# EAGLE design Antenna Board v4.2 (EAGLE 9.6.2)
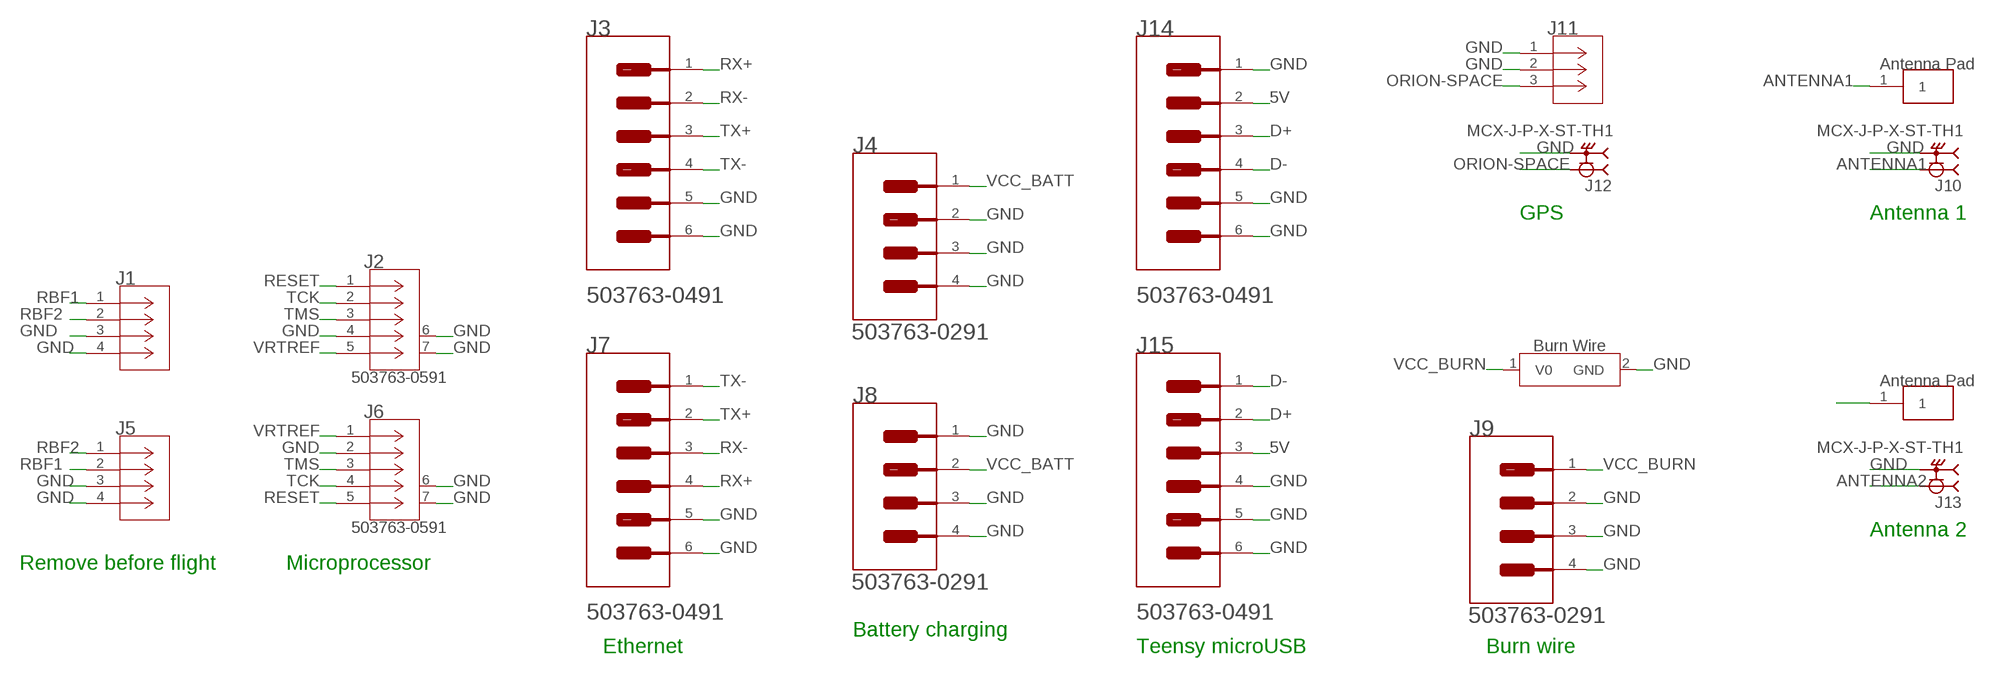
[diagram p0: schematic, sheet 1]

## Parts
J1  5037630291  [CON_5037630291]
J2  503763-0591  [CONN_5037630591_MOL]
J3  MOLEX_503763-0491MOLEX_503763-0491_0_0  [MOLEX_503763-0491_0]
J4  MOLEX_503763-0291MOLEX_503763-0291_0_0  [MOLEX_503763-0291_0]
J5  5037630291  [CON_5037630291]
J6  503763-0591  [CONN_5037630591_MOL]
J7  MOLEX_503763-0491MOLEX_503763-0491_0_0  [MOLEX_503763-0491_0]
J8  MOLEX_503763-0291MOLEX_503763-0291_0_0  [MOLEX_503763-0291_0]
J9  MOLEX_503763-0291MOLEX_503763-0291_0_0  [MOLEX_503763-0291_0]
J10  MCX-J-P-X-ST-TH1  [SAMTEC_MCX-J-P-X-ST-TH1]
J11  U.FL-R-SMT-1(01)  [CONN_-SMT-1(01)]
J12  MCX-J-P-X-ST-TH1  [SAMTEC_MCX-J-P-X-ST-TH1]
J13  MCX-J-P-X-ST-TH1  [SAMTEC_MCX-J-P-X-ST-TH1]
J14  MOLEX_503763-0491MOLEX_503763-0491_0_0  [MOLEX_503763-0491_0]
J15  MOLEX_503763-0491MOLEX_503763-0491_0_0  [MOLEX_503763-0491_0]
U$1  ANTENNA_PAD+HOLES  [ANTENNA_PAD+HOLES]
U$2  ANTENNA_PAD+HOLES  [ANTENNA_PAD+HOLES]
U$3  BURNWIRE  [BURNWIRE]

## Nets
5V: J14.2 J15.3
ANTENNA1: J10.1 U$1.1
ANTENNA2: J13.1 U$2.1
D+: J14.3 J15.2
D-: J14.4 J15.1
GND: J1.3 J1.4 J2.4 J2.6 J2.7 J3.5(MNT_1) J3.6(MNT_2) J4.2 J4.3(MNT_1) J4.4(MNT_2) J5.3 J5.4 J6.2 J6.6 J6.7 J7.5(MNT_1) J7.6(MNT_2) J8.1 J8.3(MNT_1) J8.4(MNT_2) J9.2 J9.3(MNT_1) J9.4(MNT_2) J10.S1 J10.S2 J10.S3 J10.S4 J11.1 J11.2 J12.S1 J12.S2 J12.S3 J12.S4 J13.S1 J13.S2 J13.S3 J13.S4 J14.1 J14.5(MNT_1) J14.6(MNT_2) J15.4 J15.5(MNT_1) J15.6(MNT_2) U$3.2(GND)
ORION-SPACE: J11.3 J12.1
RBF1: J1.1 J5.2
RBF2: J1.2 J5.1
RESET: J2.1 J6.5
RX+: J3.1 J7.4
RX-: J3.2 J7.3
TCK: J2.2 J6.4
TMS: J2.3 J6.3
TX+: J3.3 J7.2
TX-: J3.4 J7.1
VCC_BATT: J4.1 J8.2
VCC_BURN: J9.1 U$3.1(V0)
VRTREF: J2.5 J6.1

## Notes on the sheet
- GPS | Antenna 1
- Antenna 2
- Remove before flight | Microprocessor
- Battery charging
- Ethernet | Teensy microUSB | Burn wire

## Library data of the parts
J1 J5 = Molex_503763-0291:5037630291; BUILT_BY: Molex_Team; COPYRIGHT: Copyright (C) 2018 Accelerated Designs. All rights reserved; MANUFACTURER_PART_NUMBER: 5037630291; SOURCELIBRARY: Add_to_database_2021-03-17; VENDOR: Molex Connector Corporation
J2 J6 = Molex - 503763-0591:503763-0591; BUILT_BY: EMA_Cory; COPYRIGHT: Copyright (C) 2018 Accelerated Designs. All rights reserved; DATASHEET: https://www.molex.com/pdm_docs/sd/5037630591_sd.pdf; MANUFACTURER_PART_NUMBER: 503763-0591; SOURCELIBRARY: Add_to_database_2020-12-14; VENDOR: Molex Connector Corporation
J3 J7 J14 J15 = Molex - 503763-0491:MOLEX_503763-0491: Wire-To-Board Connector, Pico-Lock 503763 Series, Surface Mount, Header, 4 Contacts, 1 mm; AUTOMOTIVE: No; CENTROID_NOT_SPECIFIED: No; CONN_GENDER: Male; CONN_ORIENTATION: Right Angle; CONTACT_MATERIAL: Gold,Nickel; CURRENT_RATING: 1.5A; DATASHEET: https://www.molex.com/webdocs/datasheets/pdf/en-us/5037630491_PCB_HEADERS.pdf; DEVICE_CLASS_L1: Connectors; DEVICE_CLASS_L2: Headers and Wire Housings; DEVICE_CLASS_L3: unset; DIGIKEY_DESCRIPTION: CONN HEADER 1MM R/A 4CKT; DIGIKEY_PART_NUMBER: WM10655CT-ND; FOOTPRINT_URL: https://www.molex.com/pdm_docs/sd/5037630491_sd.pdf; FOOTPRINT_VARIANT_NAME_0: Recommended_Land_Pattern; HEIGHT: 1.7mm; LEAD_FREE: Yes; MF: Molex; MFG_PACKAGE_IDENT: 503763-0491; MFG_PACKAGE_IDENT_DATE: 0; MFG_PACKAGE_IDENT_REV: 0; MOUSER_PART_NUMBER: 538-503763-0491; MPN: 503763-0491; NUMBER_OF_CONTACTS: 4; NUMBER_OF_ROWS: 1; PACKAGE: HDR4; PITCH: 1mm; PREFIX: J; ROHS: Yes; TEMPERATURE_RANGE_HIGH: +105°C; TEMPERATURE_RANGE_LOW: -40°C; VERIFICATION_VERSION: 0.0.0.1; VOLTAGE_RATING: 150V
J4 J8 J9 = Molex - 503763-0291:MOLEX_503763-0291: 2 Positions Header Connector 0.039" (1.00mm) Surface Mount, Right Angle Gold; CENTROID_NOT_SPECIFIED: No; DATASHEET: http://www.molex.com/pdm_docs/sd/5037630291_sd.pdf; DIGIKEY_DESCRIPTION: CONN HEADER 1MM R/A 2CKT; DIGIKEY_PART_NUMBER: WM10654CT-ND; LEAD_FREE: yes; MF: Molex; MOUSER_PART_NUMBER: 538-503763-0291; MPN: 503763-0291; PACKAGE: HDR02; PREFIX: J; ROHS: yes; TEMPERATURE_RANGE_HIGH: +105°C; TEMPERATURE_RANGE_LOW: -40°C
J10 J12 J13 = MCX-J-P-X-ST-TH1:MCX-J-P-X-ST-TH1: 50 Ohm MCX Jack or Plug, Through-hole; DESCRIPTION: MCX Connector Jack, Female Socket 50Ohm Through Hole Solder; DIGI-KEY_PART_NUMBER: SAM8944-ND; MF: Samtec; MP: MCX-J-P-H-ST-TH1; PACKAGE: None; PURCHASE-URL: https://pricing.snapeda.com/search/part/MCX-J-P-H-ST-TH1/?ref=eda
J11 = U.FL-R-SMT-1(01):U.FL-R-SMT-1(01); BUILT_BY: EMA_Matt; COPYRIGHT: Copyright (C) 2018 Accelerated Designs. All rights reserved; MANUFACTURER_PART_NUMBER: U.FL-R-SMT-1(01); SOURCELIBRARY: Hirose_12_20_2019; VENDOR: Hirose
U$1 U$2 = Antenna_Pad:ANTENNA_PAD+HOLES
U$3 = Burn_Wire:BURNWIRE

## Board
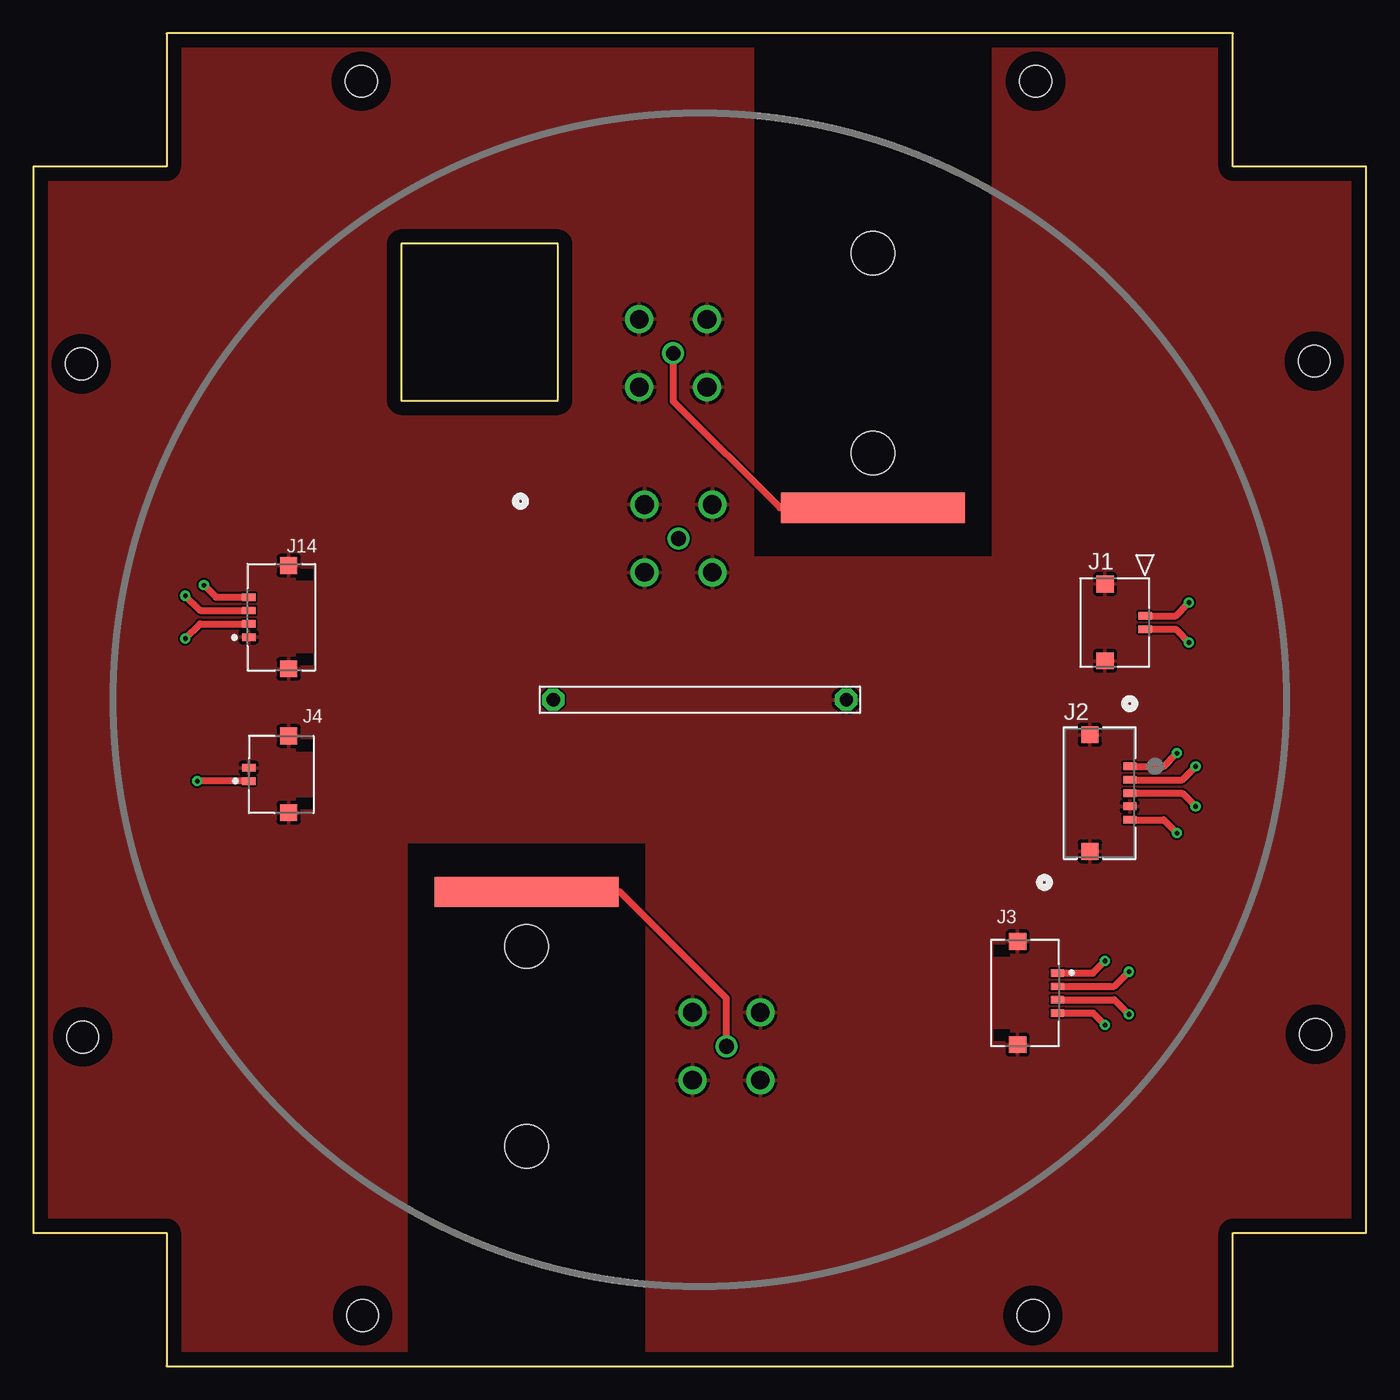
[diagram p1: board, top side]
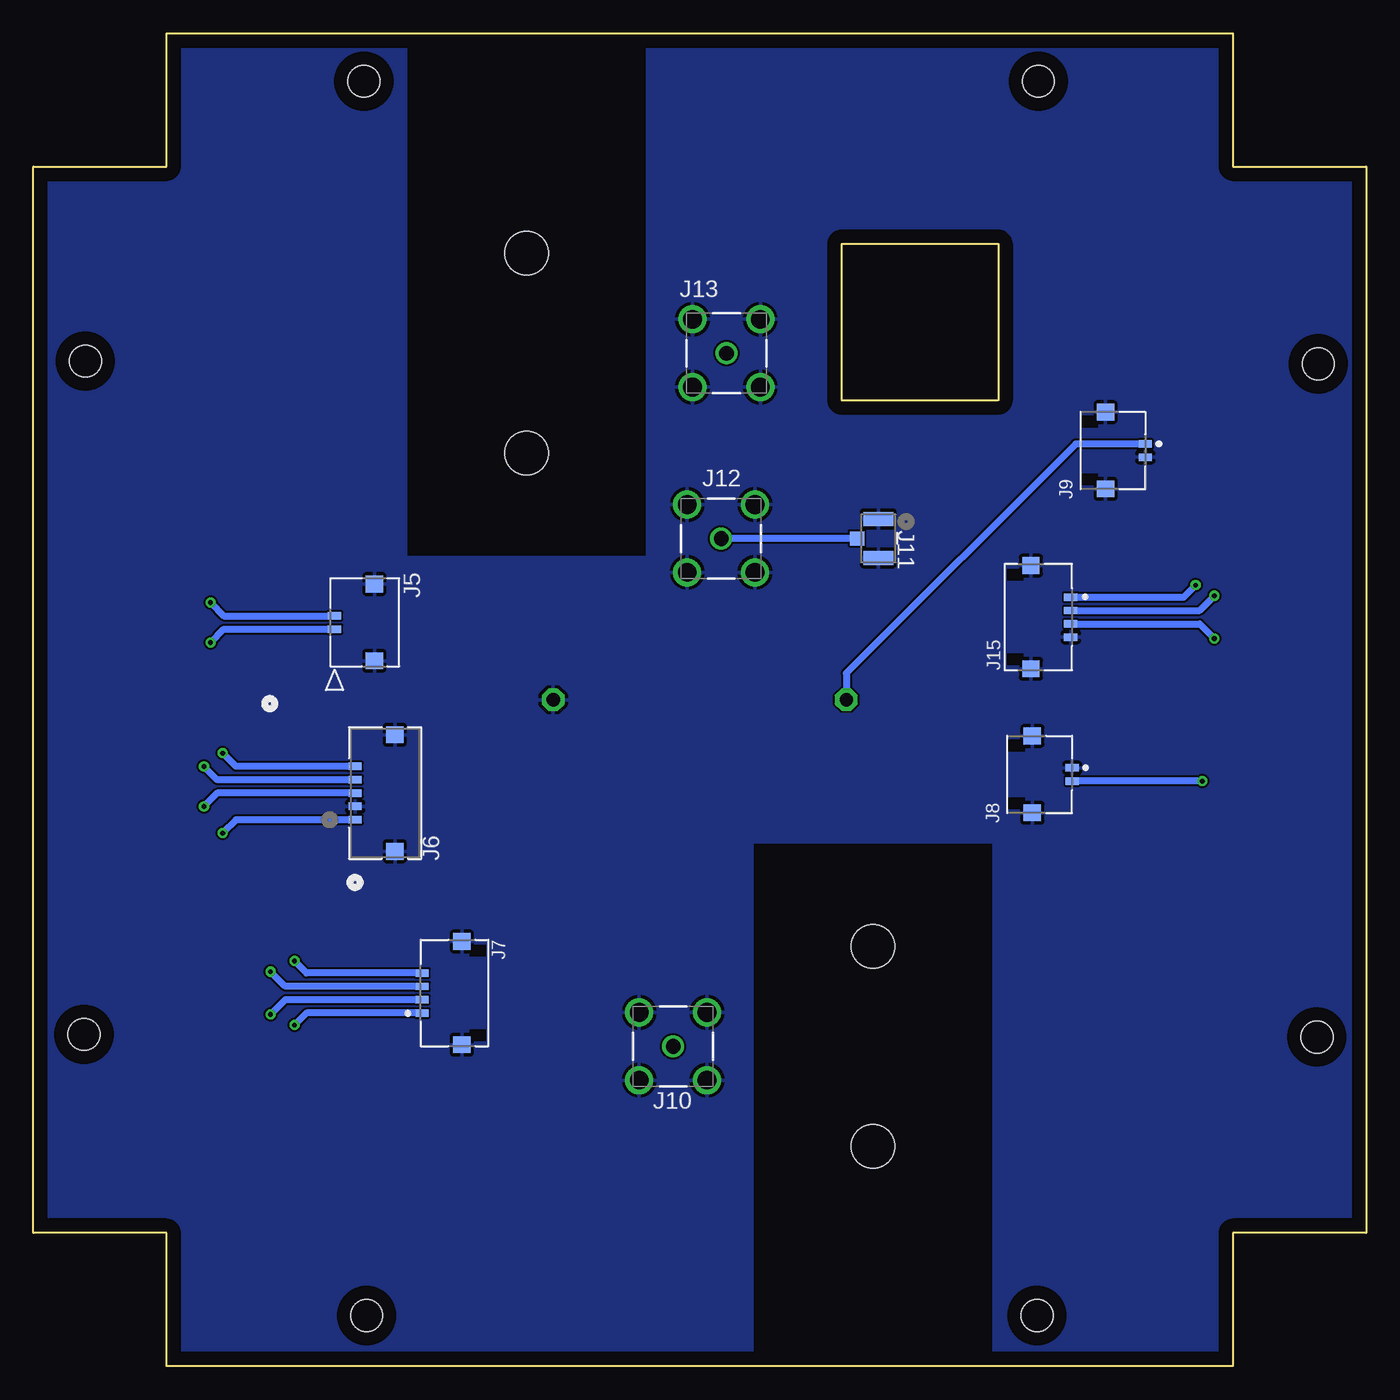
[diagram p2: board, bottom side, seen from below]

Size 100 x 100 mm. Coordinates in mm from the lower left corner, seen from the top.
Outline: 0,10 10,10 10,0 90,0 90,10 100,10 100,90 90,90 90,100 10,100 10,90 0,90 0,10
Outline: 27.6,72.45 39.35,72.45 39.35,84.2 27.6,84.2 27.6,72.45
Copper layers (1*16): Top 0.035mm / dielectric 1.5mm / Bottom 0.035mm
Design rules "default": minimum track width 6mil, minimum drill 0.35mm, track to track 6mil, track to pad 6mil, pad to pad 6mil, via to via 6mil, smd to smd 6mil, copper to edge 40mil, drill to drill 6mil, minimum pad ring 10mil, minimum via ring 8mil, stop-mask expansion 4mil, vias tented up to drill 0mil, thermal gap 10mil
Holes 2.4 mm at 3.7,24.7 24.7,3.8 75,3.8 96.2,24.9 96.1,75.4 75.2,96.4 24.6,96.4 3.6,75.2

### Footprints (pad centres in the part's own frame; a part is rotated, then mirrored left to right if it is on the bottom)
CON_5037630291 = smd 0.55 x 1: 1 0,0; 2 -1,0 | smd 1.26 x 1.3: 3 2.375,2.99; 4 -3.38,2.99
CONN_5037630591_MOL = smd 0.559 x 0.991: 1 -2,2.261; 2 -1,2.261; 3 0,2.261; 4 1,2.261; 5 2,2.261 | smd 1.27 x 1.295: 6 -4.375,-0.729; 7 4.375,-0.729
MOLEX_503763-0491_0 = smd 0.55 x 1: 1 1.5,-2.435; 2 0.5,-2.435; 3 -0.5,-2.435; 4 -1.5,-2.435 | smd 1.26 x 1.3: 5 -3.875,0.555; 6 3.875,0.555
MOLEX_503763-0291_0 = smd 0.55 x 1: 1 0.5,-2.435; 2 -0.5,-2.435 | smd 1.26 x 1.3: 3 -2.875,0.555; 4 2.875,0.555
SAMTEC_MCX-J-P-X-ST-TH1 = drill 1.1: 1 0,0 | drill 1.4: S1 -2.54,2.54; S2 2.54,2.54; S3 2.54,-2.54; S4 -2.54,-2.54
CONN_-SMT-1(01) = smd 1.041 x 2.261: 1 -1.47,0; 2 1.47,0 | smd 1.041 x 1.092: 3 0,-1.596
ANTENNA_PAD+HOLES = smd 13.8 x 2.25: 1 0,-11.6 | hole 3.26: 0,7.5; 0,-7.5
BURNWIRE = drill 1 pad 1.676 octagon: 1 -11,0; 2 11,0

### Placement (x,y rotation side)
J1  83.4,56.3 90 top
J2  80,43 270 top
J3  74.4,28 90 top
J4  18.6,44.4 270 top
J5  77.4,55.3 270 bottom
J6  73.6,43 90 bottom
J7  68.4,28 270 bottom
J8  24.5,44.4 90 bottom
J9  19,68.7 90 bottom
J10  52,24 0 bottom
J11  36.6,62.1 270 bottom
J12  48.4,62.1 0 bottom
J13  48,76 0 bottom
J14  18.6,56.2 270 top
J15  24.6,56.2 90 bottom
U$1  37,24 180 top
U$2  63,76 0 top
U$3  50,50 0 top

### Tracks (layer width: path | path; a pad name or v marks a point on that pad's centre or on a via)
5V  (via drill 0.35)
  Top 0.508: v11.4,54.6 12.5,55.7 J14.2
  Bottom 0.508: J15.3 12.5,55.7 v11.4,54.6
ANTENNA1
  Top 0.508: U$1.1 44,35.6 52,27.6 J10.1
ANTENNA2
  Top 0.508: U$2.1 56,64.4 48,72.4 J13.1
D+  (via drill 0.35)
  Top 0.508: v11.4,57.8 12.5,56.7 J14.3
  Bottom 0.508: J15.2 12.5,56.7 v11.4,57.8
D-  (via drill 0.35)
  Top 0.508: v12.8,58.6 13.7,57.7 J14.4
  Bottom 0.508: J15.1 13.7,57.7 v12.8,58.6
GND
  pour Top: -1,-1 -1,101 54,101 54,60.7 72,60.7 72,101 101,101 101,-1 46,-1 46,39.3 28,39.3 28,-1
  pour Bottom: -1.4,-1.4 -1.4,101.4 54,101.4 54,60.7 72,60.7 72,101.4 101.4,101.4 101.4,-1.4 46,-1.4 46,39.3 28,39.3 28,-1.4
ORION-SPACE
  Bottom 0.508: J11.3 J12.1
RBF1  (via drill 0.35)
  Top 0.508: J1.1 85.7,56.3 v86.7,57.3
  Bottom 0.508: v86.7,57.3 85.7,56.3 J5.2
RBF2  (via drill 0.35)
  Top 0.508: J1.2 85.7,55.3 v86.7,54.3
  Bottom 0.508: v86.7,54.3 85.7,55.3 J5.1
RESET  (via drill 0.35)
  Top 0.508: J2.1 84.8,45 v85.8,46
  Bottom 0.508: J6.5 84.8,45 v85.8,46
RX+  (via drill 0.35)
  Top 0.508: J3.1 79.5,29.5 v80.4,30.4
  Bottom 0.508: J7.4 79.5,29.5 v80.4,30.4
RX-  (via drill 0.35)
  Top 0.508: J3.2 81.1,28.5 v82.2,29.6
  Bottom 0.508: J7.3 81.1,28.5 v82.2,29.6
TCK  (via drill 0.35)
  Top 0.508: J2.2 86.2,44 v87.2,45
  Bottom 0.508: J6.4 86.2,44 v87.2,45
TMS  (via drill 0.35)
  Top 0.508: J2.3 86.2,43 v87.2,42
  Bottom 0.508: J6.3 86.2,43 v87.2,42
TX+  (via drill 0.35)
  Top 0.508: J3.3 81.1,27.5 v82.2,26.4
  Bottom 0.508: J7.2 81.1,27.5 v82.2,26.4
TX-  (via drill 0.35)
  Top 0.508: J3.4 79.5,26.5 v80.4,25.6
  Bottom 0.508: J7.1 79.5,26.5 v80.4,25.6
VCC_BATT  (via drill 0.35)
  Top 0.508: J4.1 v12.3,43.9
  Bottom 0.508: v12.3,43.9 J8.2
VCC_BURN
  Bottom 0.508: J9.1 21.8,69.2 39,52 U$3.1
VRTREF  (via drill 0.35)
  Top 0.508: J2.5 84.8,41 v85.8,40
  Bottom 0.508: J6.1 84.8,41 v85.8,40